# Altium schematic sheet BQ76940.SchDoc
size A4
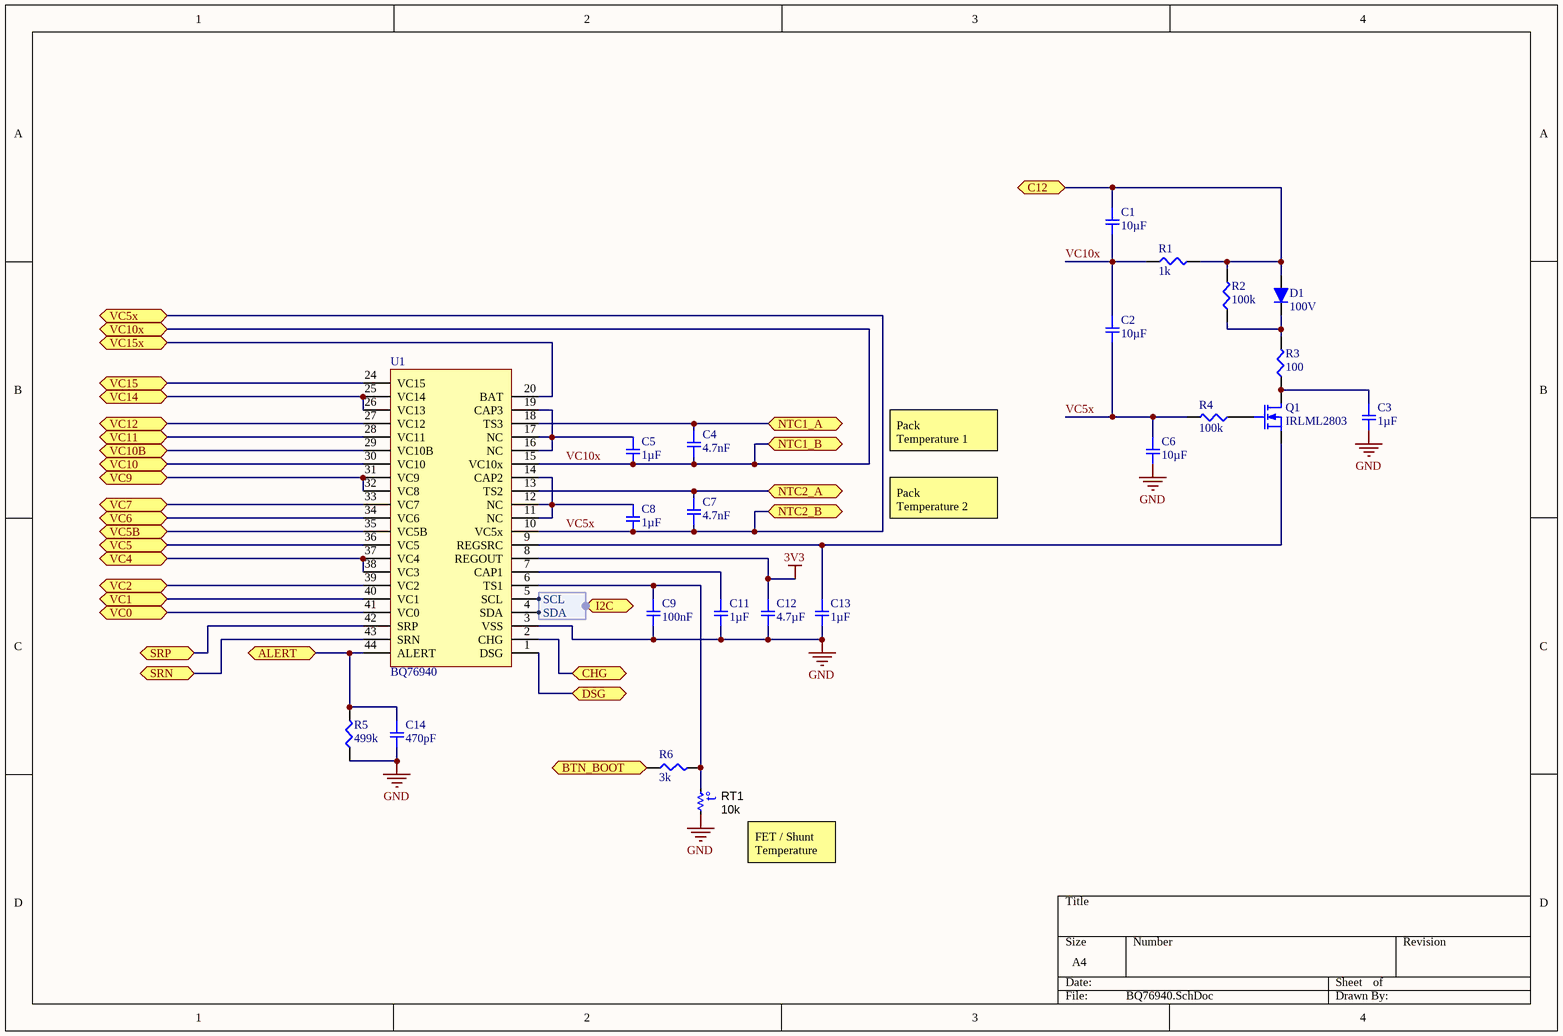
[diagram p0: BQ76940.SchDoc]

## Parts
C1  10µF  [SMD-0603C]
C2  10µF  [SMD-0603C]
C3  1µF  [SMD-0603C]
C4  4.7nF  [SMD-0603C]
C5  1µF  [SMD-0603C]
C6  10µF  [SMD-0603C]
C7  4.7nF  [SMD-0603C]
C8  1µF  [SMD-0603C]
C9  100nF  [SMD-0603C]
C11  1µF  [SMD-0603C]
C12  4.7µF  [SMD-0603C]
C13  1µF  [SMD-0603C]
C14  470pF  [SMD-0603C]
D1  100V  [SOD-323]
Q1  IRLML2803  [SOT23-3]
R1  1k  [SMD-0603-RES]
R2  100k  [SMD-0603-RES]
R3  100  [SMD-0603-RES]
R4  100k  [SMD-0603-RES]
R5  499k  [SMD-0603-RES]
R6  3k  [SMD-0603-RES]
RT1  value 10k  [SMD-0603-RES]  (hidden comment: NTC)
U1  BQ76940  [TSSOP44]

## Ports
ALERT, BTN_BOOT, C12, CHG, DSG, I2C (harness I2C), NTC1_A, NTC1_B, NTC2_A, NTC2_B, SRN, SRP, VC0, VC1, VC2, VC4, VC5, VC5B, VC5x, VC6, VC7, VC9, VC10, VC10B, VC10x, VC11, VC12, VC14, VC15, VC15x

## Harnesses
I2C: SCL, SDA

## Nets
3V3: C12.1 U1.8(REGOUT)
GND: C3.2 C6.2 C9.2 C11.2 C12.2 C13.2 C14.2 R5.1 RT1.1 U1.3(VSS)
ALERT: C14.1 R5.2 U1.44(ALERT) ; port ALERT
BTN_BOOT: R6.1 ; port BTN_BOOT
C12: C1.1 D1.2(A) R1.2 R2.2 ; port C12
CHG: U1.2(CHG) ; port CHG
DSG: U1.1(DSG) ; port DSG
NTC1_A: C4.1 U1.18(TS3) ; port NTC1_A
NTC2_A: C7.1 U1.13(TS2) ; port NTC2_A
SRN: U1.43(SRN) ; port SRN
SRP: U1.42(SRP) ; port SRP
VC0: U1.41(VC0) ; port VC0
VC1: U1.40(VC1) ; port VC1
VC2: U1.39(VC2) ; port VC2
VC4: U1.37(VC4) U1.38(VC3) ; port VC4
VC5: U1.36(VC5) ; port VC5
VC5B: U1.35(VC5B) ; port VC5B
VC5x: C2.2 C6.1 C7.2 C8.2 R4.2 U1.10(VC5x) ; port VC5x, port NTC2_B
VC6: U1.34(VC6) ; port VC6
VC7: U1.33(VC7) ; port VC7
VC9: U1.31(VC9) U1.32(VC8) ; port VC9
VC10: U1.30(VC10) ; port VC10
VC10B: U1.29(VC10B) ; port VC10B
VC10x: C1.2 C2.1 C4.2 C5.2 R1.1 U1.15(VC10x) ; port VC10x, port NTC1_B
VC11: U1.28(VC11) ; port VC11
VC12: U1.27(VC12) ; port VC12
VC14: U1.25(VC14) U1.26(VC13) ; port VC14
VC15: U1.24(VC15) ; port VC15
VC15x: U1.20(BAT) ; port VC15x
NetC3_1: C3.1 Q1.3(D) R3.1
NetC5_1: C5.1 U1.16(NC) U1.17(NC) U1.19(CAP3)
NetC8_1: C8.1 U1.11(NC) U1.12(NC) U1.14(CAP2)
NetC9_1: C9.1 R6.2 RT1.2 U1.6(TS1)
NetC11_1: C11.1 U1.7(CAP1)
NetC13_1: C13.1 Q1.2(S) U1.9(REGSRC)
NetD1_1: D1.1(K) R2.1 R3.2
NetQ1_1: Q1.1(G) R4.1
NetU1_4: U1.4(SDA) ; port I2C.SDA
NetU1_5: U1.5(SCL) ; port I2C.SCL

## Notes on the sheet
- Pack
  Temperature 1
- Pack
  Temperature 2
- (near RT1) FET / Shunt
  Temperature
- (in symbol NTC) t°

## Library data of the parts
C1 C2 C6 = GRM185R60J106ME15D: CAP CER 10UF 6.3V X5R 0603; Manufacturer: Murata Electronics North America; Factory Stock: 0; Unit Price (USD): 0.36; Minimum Quantity: 1; Tolerance: ±20%; Datasheets: http://www.murata.com/~/media/webrenewal/support/library/catalog/products/capacitor/mlcc/c02e.pdf; Image: //media.digikey.com/Renders/Murata%20Renders/ZRB-SERIES-0402.jpg; Digi-Key Part Number: 490-10467-1-ND; Part Number: GRM185R60J106ME15D; Quantity Available: 25068; @ qty: 0; Packaging: Cut Tape (CT); Series: GRM; Part Status: Active; Value: 10µF; Voltage: 6.3V; Temperature Coefficient: X5R; Operating Temperature: -55°C ~ 85°C; Features: Derating Recommended; Ratings: -; Applications: General Purpose; Mounting Type: Surface Mount, MLCC; Package / Case: 0603 (1608 Metric); Size / Dimension: 0.063" L x 0.031" W (1.60mm x 0.80mm); Height - Seated (Max): -; Thickness (Max): 0.022" (0.55mm); Lead Spacing: -; Lead Style: -
C3 C5 C8 C11 C13 = GCM188R71C105KA64D: CAP CER 1UF 16V X7R 0603; Manufacturer: Murata Electronics North America; Factory Stock: 0; Unit Price (USD): 0.24; Minimum Quantity: 1; Tolerance: ±10%; Datasheets: http://www.murata.com/~/media/webrenewal/support/library/catalog/products/capacitor/mlcc/c03e.ashx; Image: //media.digikey.com/Renders/Murata%20Renders/0603%28GCM188%29.jpg; Digi-Key Part Number: 490-5241-1-ND; Part Number: GCM188R71C105KA64D; Quantity Available: 9243; @ qty: 0; Packaging: Cut Tape (CT); Series: GCM; Part Status: Active; Value: 1µF; Voltage: 16V; Temperature Coefficient: X7R; Operating Temperature: -55°C ~ 125°C; Features: -; Ratings: AEC-Q200; Applications: Automotive; Mounting Type: Surface Mount, MLCC; Package / Case: 0603 (1608 Metric); Size / Dimension: 0.063" L x 0.031" W (1.60mm x 0.80mm); Height - Seated (Max): -; Thickness (Max): 0.035" (0.90mm); Lead Spacing: -; Lead Style: -
C4 C7 = GRJ188R71H472KE11D: CAP CER 4700PF 50V X7R 0603; Manufacturer: Murata Electronics North America; Factory Stock: 0; Unit Price (USD): 0.1; Minimum Quantity: 1; Tolerance: ±10%; Datasheets: http://www.murata.com/~/media/webrenewal/support/library/catalog/products/capacitor/mlcc/c02e.pdf; Image: //media.digikey.com/Renders/Murata%20Renders/0603%28LQG18%29.jpg; Digi-Key Part Number: 490-10897-1-ND; Part Number: GRJ188R71H472KE11D; Quantity Available: 7696; @ qty: 0; Packaging: Cut Tape (CT); Series: GRJ; Part Status: Active; Value: 4700pF; Voltage: 50V; Temperature Coefficient: X7R; Operating Temperature: -55°C ~ 125°C; Features: Soft Termination; Ratings: -; Applications: Boardflex Sensitive; Mounting Type: Surface Mount, MLCC; Package / Case: 0603 (1608 Metric); Size / Dimension: 0.063" L x 0.031" W (1.60mm x 0.80mm); Height - Seated (Max): -; Thickness (Max): 0.035" (0.90mm); Lead Spacing: -; Lead Style: -
C9 = GCJ188R71C104KA01D: CAP CER 0.1UF 16V X7R 0603; Manufacturer: Murata Electronics North America; Factory Stock: 0; Unit Price (USD): 0.21; Minimum Quantity: 1; Value: 0.10µF; Tolerance: ±10%; Datasheets: http://www.murata.com/~/media/webrenewal/support/library/catalog/products/capacitor/mlcc/c03e.ashx; Image: //media.digikey.com/Renders/Murata%20Renders/0603%28LQG18%29.jpg; Digi-Key Part Number: 490-5796-1-ND; Part Number: GCJ188R71C104KA01D; Quantity Available: 22473; @ qty: 0; Packaging: Cut Tape (CT); Series: GCJ; Part Status: Active; Voltage: 16V; Temperature Coefficient: X7R; Operating Temperature: -55°C ~ 125°C; Features: Soft Termination; Ratings: AEC-Q200; Applications: Automotive, Boardflex Sensitive; Mounting Type: Surface Mount, MLCC; Package / Case: 0603 (1608 Metric); Size / Dimension: 0.063" L x 0.031" W (1.60mm x 0.80mm); Height - Seated (Max): -; Thickness (Max): 0.035" (0.90mm); Lead Spacing: -; Lead Style: -
C12 = GRJ188C70J475KE11D: CAP CER 4.7UF 6.3V X7S 0603; Manufacturer: Murata Electronics North America; Factory Stock: 0; Unit Price (USD): 0.34; Minimum Quantity: 1; Tolerance: ±10%; Datasheets: http://www.murata.com/~/media/webrenewal/support/library/catalog/products/capacitor/mlcc/c02e.pdf; Image: //media.digikey.com/Renders/Murata%20Renders/0603%28LQG18%29.jpg; Digi-Key Part Number: 490-10884-1-ND; Part Number: GRJ188C70J475KE11D; Quantity Available: 9234; @ qty: 0; Packaging: Cut Tape (CT); Series: GRJ; Part Status: Active; Value: 4.7µF; Voltage: 6.3V; Temperature Coefficient: X7S; Operating Temperature: -55°C ~ 125°C; Features: Soft Termination; Ratings: -; Applications: Boardflex Sensitive; Mounting Type: Surface Mount, MLCC; Package / Case: 0603 (1608 Metric); Size / Dimension: 0.063" L x 0.031" W (1.60mm x 0.80mm); Height - Seated (Max): -; Thickness (Max): 0.039" (1.00mm); Lead Spacing: -; Lead Style: -
C14 = GCM1885C1H471JA16D: CAP CER 470PF 50V NP0 0603; Manufacturer: Murata Electronics North America; Factory Stock: 0; Unit Price (USD): 0.1; Minimum Quantity: 1; Tolerance: ±5%; Temperature Coefficient: C0G, NP0; Datasheets: http://www.murata.com/~/media/webrenewal/support/library/catalog/products/capacitor/mlcc/c03e.ashx; Image: //media.digikey.com/Renders/Murata%20Renders/0603%28GCM188%29.jpg; Digi-Key Part Number: 490-4965-1-ND; Part Number: GCM1885C1H471JA16D; Quantity Available: 32645; @ qty: 0; Packaging: Cut Tape (CT); Series: GCM; Part Status: Active; Value: 470pF; Voltage: 50V; Operating Temperature: -55°C ~ 125°C; Features: -; Ratings: AEC-Q200; Applications: Automotive; Mounting Type: Surface Mount, MLCC; Package / Case: 0603 (1608 Metric); Size / Dimension: 0.063" L x 0.031" W (1.60mm x 0.80mm); Height - Seated (Max): -; Thickness (Max): 0.035" (0.90mm); Lead Spacing: -; Lead Style: -
D1 = DIODE
Q1 = MOSFET-N: N-Channel MOSFET; Published: 8-Jun-2000; LatestRevisionDate: 17-Jul-2002; LatestRevisionNote: Re-released for DXP Platform.; PackageVersion: 1995/1996; PackageReference: E3; Publisher: Altium Limited; PackageDescription: TO, Flat Index; 3 In-Line, Axial Leads; Body Dia. 4.6mm; Lead Dia. 0.5 mm (max)
R1 = ERJ-3EKF1001V: RES SMD 1K OHM 1% 1/10W 0603; Manufacturer: Panasonic Electronic Components; Factory Stock: 0; Unit Price (USD): 0.00379; @ qty: 1500; Minimum Quantity: 1; Power (Watts): 0.1W, 1/10W; Temperature Coefficient: ±100ppm/°C; Part Number: ERJ-3EKF1001V; Datasheets: http://industrial.panasonic.com/www-cgi/jvcr13pz.cgi?E+PZ+3+AOA0002+ERJ3EKF1001V+7+WW; Image: //media.digikey.com/Photos/Panasonic%20Photos/MFG_ERJ-P6W%20Series.jpg; Digi-Key Part Number: P1.00KHCT-ND; Quantity Available: 5218845; Packaging: Cut Tape (CT); Series: ERJ; Part Status: Active; Value: 1k; Tolerance: ±1%; Composition: Thick Film; Features: Automotive AEC-Q200; Operating Temperature: -55°C ~ 155°C; Package / Case: 0603 (1608 Metric); Supplier Device Package: 0603; Size / Dimension: 0.063" L x 0.031" W (1.60mm x 0.80mm); Height - Seated (Max): 0.022" (0.55mm); Number of Terminations: 2; Failure Rate: -
R2 R4 = ERJ-3EKF1003V: RES SMD 100K OHM 1% 1/10W 0603; Manufacturer: Panasonic Electronic Components; Factory Stock: 0; Unit Price (USD): 0.00379; @ qty: 1500; Minimum Quantity: 1; Power (Watts): 0.1W, 1/10W; Temperature Coefficient: ±100ppm/°C; Part Number: ERJ-3EKF1003V; Datasheets: http://industrial.panasonic.com/www-cgi/jvcr13pz.cgi?E+PZ+3+AOA0002+ERJ3EKF1003V+7+WW; Image: //media.digikey.com/Photos/Panasonic%20Photos/MFG_ERJ-P6W%20Series.jpg; Digi-Key Part Number: P100KHCT-ND; Quantity Available: 2179804; Packaging: Cut Tape (CT); Series: ERJ; Part Status: Active; Value: 100k; Tolerance: ±1%; Composition: Thick Film; Features: Automotive AEC-Q200; Operating Temperature: -55°C ~ 155°C; Package / Case: 0603 (1608 Metric); Supplier Device Package: 0603; Size / Dimension: 0.063" L x 0.031" W (1.60mm x 0.80mm); Height - Seated (Max): 0.022" (0.55mm); Number of Terminations: 2; Failure Rate: -
R3 = ERJ-3EKF1000V: RES SMD 100 OHM 1% 1/10W 0603; Manufacturer: Panasonic Electronic Components; Factory Stock: 0; Unit Price (USD): 0.00379; @ qty: 1500; Minimum Quantity: 1; Power (Watts): 0.1W, 1/10W; Temperature Coefficient: ±100ppm/°C; Part Number: ERJ-3EKF1000V; Datasheets: http://industrial.panasonic.com/www-cgi/jvcr13pz.cgi?E+PZ+3+AOA0002+ERJ3EKF1000V+7+WW; Image: //media.digikey.com/Photos/Panasonic%20Photos/MFG_ERJ-P6W%20Series.jpg; Digi-Key Part Number: P100HCT-ND; Quantity Available: 1544120; Packaging: Cut Tape (CT); Series: ERJ; Part Status: Active; Value: 100; Tolerance: ±1%; Composition: Thick Film; Features: Automotive AEC-Q200; Operating Temperature: -55°C ~ 155°C; Package / Case: 0603 (1608 Metric); Supplier Device Package: 0603; Size / Dimension: 0.063" L x 0.031" W (1.60mm x 0.80mm); Height - Seated (Max): 0.022" (0.55mm); Number of Terminations: 2; Failure Rate: -
R5 = ERJ-3EKF4993V: RES SMD 499K OHM 1% 1/10W 0603; Manufacturer: Panasonic Electronic Components; Factory Stock: 0; Unit Price (USD): 0.00379; @ qty: 1500; Minimum Quantity: 1; Power (Watts): 0.1W, 1/10W; Temperature Coefficient: ±100ppm/°C; Part Number: ERJ-3EKF4993V; Datasheets: http://industrial.panasonic.com/www-cgi/jvcr13pz.cgi?E+PZ+3+AOA0002+ERJ3EKF4993V+7+WW; Image: //media.digikey.com/Photos/Panasonic%20Photos/MFG_ERJ-P6W%20Series.jpg; Digi-Key Part Number: P499KHCT-ND; Quantity Available: 110332; Packaging: Cut Tape (CT); Series: ERJ; Part Status: Active; Value: 499k; Tolerance: ±1%; Composition: Thick Film; Features: Automotive AEC-Q200; Operating Temperature: -55°C ~ 155°C; Package / Case: 0603 (1608 Metric); Supplier Device Package: 0603; Size / Dimension: 0.063" L x 0.031" W (1.60mm x 0.80mm); Height - Seated (Max): 0.022" (0.55mm); Number of Terminations: 2; Failure Rate: -
R6 = ERJ-3EKF3001V: RES SMD 3K OHM 1% 1/10W 0603; Manufacturer: Panasonic Electronic Components; Factory Stock: 0; Unit Price (USD): 0.00379; @ qty: 1500; Minimum Quantity: 1; Power (Watts): 0.1W, 1/10W; Temperature Coefficient: ±100ppm/°C; Part Number: ERJ-3EKF3001V; Datasheets: http://industrial.panasonic.com/www-cgi/jvcr13pz.cgi?E+PZ+3+AOA0002+ERJ3EKF3001V+7+WW; Image: //media.digikey.com/Photos/Panasonic%20Photos/MFG_ERJ-P6W%20Series.jpg; Digi-Key Part Number: P3.00KHCT-ND; Quantity Available: 43631; Packaging: Cut Tape (CT); Series: ERJ; Part Status: Active; Value: 3k; Tolerance: ±1%; Composition: Thick Film; Features: Automotive AEC-Q200; Operating Temperature: -55°C ~ 155°C; Package / Case: 0603 (1608 Metric); Supplier Device Package: 0603; Size / Dimension: 0.063" L x 0.031" W (1.60mm x 0.80mm); Height - Seated (Max): 0.022" (0.55mm); Number of Terminations: 2; Failure Rate: -
RT1 = NTC: Thermistor NTC, 10.0k ohm, 1%; Manufacturer: SEMITEC Corporation; PartNumber: 103AT-2; Tolerance_%: 1; Power_W: 0.01; TaMin_C: -50; TaMax_C: 110; U/M: EA; ComponentLink1URL: http://www.semitec.co.jp/english2/products/pdf/AT_Thermistor.pdf; PackageReference: Disc, 5x8.4 mm; SymbolVersion: 2008-11-25; ComponentLink1Description: Datasheet link; CompType: ThermistorNTC; Series: AT; MountType: TH; RoHS: Y; Published: 2009-09-22; Publisher: Texas Instruments; LatestRevisionDate: 2013-08-16; Supplier 1: Mouser; Supplier Part Number 1: 954-103AT-2